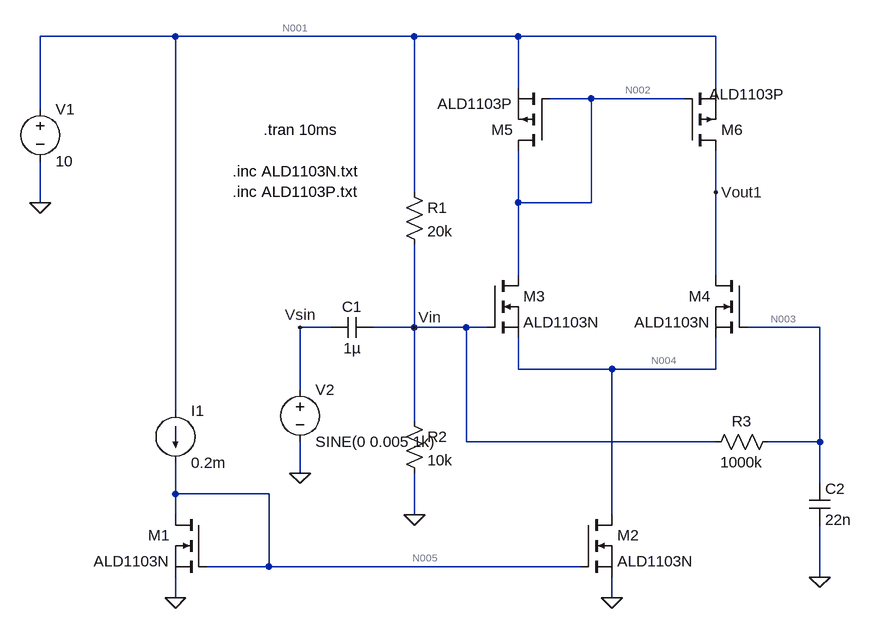
[diagram p0: schematic exp2.asc]
exp2.asc, the LTspice schematic file:
Version 4.1
SHEET 1 880 680
WIRE -288 -656 -496 -656
WIRE 80 -656 -288 -656
WIRE 240 -656 80 -656
WIRE 544 -656 240 -656
WIRE 240 -576 240 -656
WIRE 544 -576 544 -656
WIRE 352 -560 288 -560
WIRE 496 -560 352 -560
WIRE -496 -544 -496 -656
WIRE 80 -416 80 -656
WIRE 544 -416 544 -480
WIRE -496 -400 -496 -464
WIRE 240 -400 240 -480
WIRE 352 -400 352 -560
WIRE 352 -400 240 -400
WIRE 240 -288 240 -400
WIRE 544 -288 544 -416
WIRE -48 -208 -96 -208
WIRE 80 -208 80 -336
WIRE 80 -208 16 -208
WIRE 160 -208 80 -208
WIRE 192 -208 160 -208
WIRE 704 -208 592 -208
WIRE 240 -144 240 -192
WIRE 384 -144 240 -144
WIRE 544 -144 544 -192
WIRE 544 -144 384 -144
WIRE -96 -112 -96 -208
WIRE -288 -80 -288 -656
WIRE 80 -64 80 -208
WIRE 160 -32 160 -208
WIRE 544 -32 160 -32
WIRE 704 -32 704 -208
WIRE 704 -32 624 -32
WIRE -96 16 -96 -32
WIRE 704 32 704 -32
WIRE -288 48 -288 0
WIRE -144 48 -288 48
WIRE -288 80 -288 48
WIRE 80 80 80 16
WIRE 384 80 384 -144
WIRE -144 160 -144 48
WIRE -144 160 -240 160
WIRE 336 160 -144 160
WIRE 704 176 704 96
WIRE -288 208 -288 176
WIRE 384 208 384 176
FLAG -288 208 0
FLAG 384 208 0
FLAG -496 -400 0
FLAG -96 16 0
FLAG 80 80 0
FLAG 704 176 0
FLAG 80 -208 Vin
FLAG -96 -208 Vsin
FLAG 544 -416 Vout1
SYMBOL nmos -240 80 M0
SYMATTR InstName M1
SYMATTR Value ALD1103N
SYMBOL nmos 336 80 R0
SYMATTR InstName M2
SYMATTR Value ALD1103N
SYMBOL nmos 192 -288 R0
SYMATTR InstName M3
SYMATTR Value ALD1103N
SYMBOL nmos 592 -288 M0
SYMATTR InstName M4
SYMATTR Value ALD1103N
SYMBOL pmos 288 -480 R180
SYMATTR InstName M5
SYMATTR Value ALD1103P
SYMBOL pmos 496 -480 M180
WINDOW 3 38 87 Left 2
SYMATTR InstName M6
SYMATTR Value ALD1103P
SYMBOL current -288 -80 R0
WINDOW 123 0 0 Left 0
WINDOW 39 0 0 Left 0
SYMATTR InstName I1
SYMATTR Value 0.2m
SYMBOL voltage -496 -560 R0
WINDOW 123 0 0 Left 0
WINDOW 39 0 0 Left 0
SYMATTR InstName V1
SYMATTR Value 10
SYMBOL voltage -96 -128 R0
WINDOW 123 0 0 Left 0
WINDOW 39 0 0 Left 0
SYMATTR InstName V2
SYMATTR Value SINE(0 0.005 1k)
SYMBOL cap 16 -224 R90
WINDOW 0 0 32 VBottom 2
WINDOW 3 32 32 VTop 2
SYMATTR InstName C1
SYMATTR Value 1µ
SYMBOL res 64 -432 R0
SYMATTR InstName R1
SYMATTR Value 20k
SYMBOL res 64 -80 R0
SYMATTR InstName R2
SYMATTR Value 10k
SYMBOL res 640 -48 R90
WINDOW 0 0 56 VBottom 2
WINDOW 3 32 56 VTop 2
SYMATTR InstName R3
SYMATTR Value 1000k
SYMBOL cap 688 32 R0
SYMATTR InstName C2
SYMATTR Value 22n
TEXT -200 -448 Left 2 !.inc ALD1103N.txt\n.inc ALD1103P.txt
TEXT -152 -512 Left 2 !.tran 10ms

The netlist it stands for:
* exp2.asc
M1 N005 N005 0 0 ALD1103N
M2 N004 N005 0 0 ALD1103N
M3 N002 Vin N004 N004 ALD1103N
M4 Vout1 N003 N004 N004 ALD1103N
M5 N002 N002 N001 N001 ALD1103P
M6 Vout1 N002 N001 N001 ALD1103P
I1 N001 N005 0.2m
V1 N001 0 10
V2 Vsin 0 SINE(0 0.005 1k)
C1 Vin Vsin 1µ
R1 N001 Vin 20k
R2 Vin 0 10k
R3 N003 Vin 1000k
C2 N003 0 22n
.model NMOS NMOS
.model PMOS PMOS
.lib standard.mos
.inc ALD1103N.txt
.inc ALD1103P.txt
.tran 10ms
.backanno
.end

* Results of the author's LTspice run, read from the files saved beside the schematic
* Operating Point, zero values left out:
*   V(n004) = 2.53 V
*   V(vin) = 3.333 V
*   V(vout1) = 9.08 V
*   V(n001) = 10 V
*   V(n005) = 897.9 mV
*   V(n002) = 9.08 V
*   V(n003) = 3.333 V
*   Id(M1) = 200 µA
*   Is(M1) = -200 µA
*   Id(M5) = -109.7 µA
*   Is(M5) = 109.7 µA
*   Id(M6) = -109.7 µA
*   Is(M6) = 109.7 µA
*   I(V1) = -752.7 µA
*   Id(M3) = 109.7 µA
*   Is(M3) = -109.7 µA
*   Ib(M3) = -6.56 pA
*   I(R1) = 333.3 µA
*   Id(M4) = 109.7 µA
*   Is(M4) = -109.7 µA
*   Ib(M4) = -6.56 pA
*   I(I1) = 200 µA
*   I(R2) = 333.3 µA
*   Id(M2) = 219.4 µA
*   Is(M2) = -219.4 µA
*   Ib(M2) = -2.54 pA
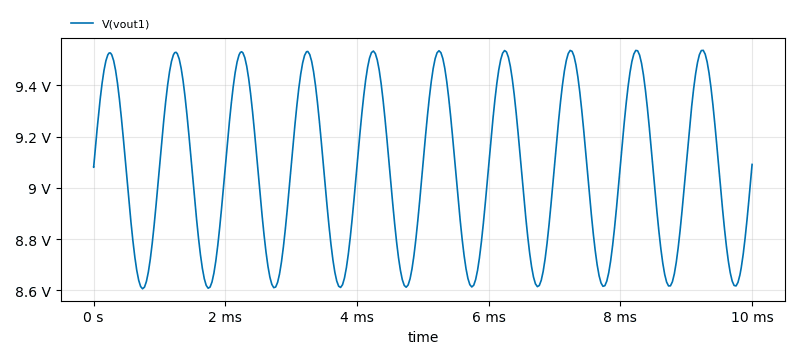
[diagram p1: Transient Analysis of exp2.asc, plotted from the saved traces]
* Transient Analysis, 1 run:
*   V(vout1): min 8.607 V, max 9.536 V, average 9.073 V, rms 9.079 V, last 9.091 V